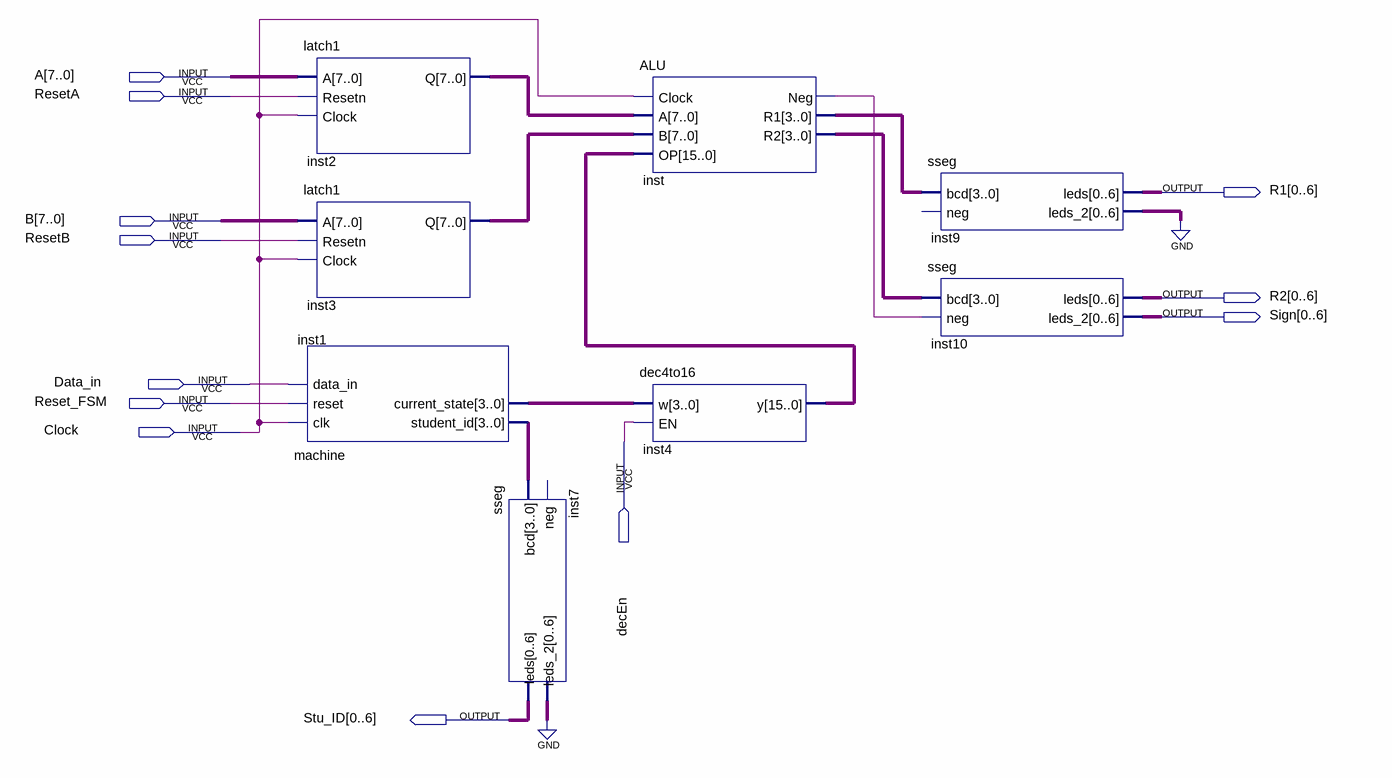
[diagram p0: schematic sheet]
// Quartus schematic ALUBlock.bdf as structural Verilog: 8 symbols, 12 pins
module ALUBlock (
  input  [7:0] A,
  input  ResetA,
  input  [7:0] B,
  input  ResetB,
  input  Data_in,
  input  Reset_FSM,
  input  Clock,
  input  decEn,
  output [0:6] R1,
  output [0:6] R2,
  output [0:6] Sign,
  output [0:6] Stu_ID
);

  wire inst_neg;
  wire [3:0] inst1_current_state, inst1_student_id, inst_r1, inst_r2;
  wire [6:0] inst7_leds_2, inst9_leds_2;
  wire [7:0] inst2_q, inst3_q;
  wire [15:0] inst4_y;

  latch1 inst2 (.A(A), .Resetn(ResetA), .Clock(Clock), .Q(inst2_q));
  latch1 inst3 (.A(B), .Resetn(ResetB), .Clock(Clock), .Q(inst3_q));
  machine inst1 (
    .clk(Clock), .reset(Reset_FSM), .data_in(Data_in), .student_id(inst1_student_id),
    .current_state(inst1_current_state));
  sseg inst7 (.bcd(inst1_student_id), .leds(Stu_ID), .leds_2(inst7_leds_2));  // open: neg
  ALU inst (.Clock(Clock), .A(inst2_q), .B(inst3_q), .OP(inst4_y), .Neg(inst_neg), .R1(inst_r1), .R2(inst_r2));
  dec4to16 inst4 (.w(inst1_current_state), .EN(decEn), .y(inst4_y));
  sseg inst9 (.bcd(inst_r1), .leds(R1), .leds_2(inst9_leds_2));  // open: neg
  sseg inst10 (.bcd(inst_r2), .neg(inst_neg), .leds(R2), .leds_2(Sign));
  // also tied to GND on the sheet: {inst7_leds_2[0], inst7_leds_2[1], inst7_leds_2[2], inst7_leds_2[3], inst7_leds_2[4], inst7_leds_2[5], inst7_leds_2[6], inst9_leds_2[0], inst9_leds_2[1], inst9_leds_2[2], inst9_leds_2[3], inst9_leds_2[4], inst9_leds_2[5], inst9_leds_2[6]}
endmodule
